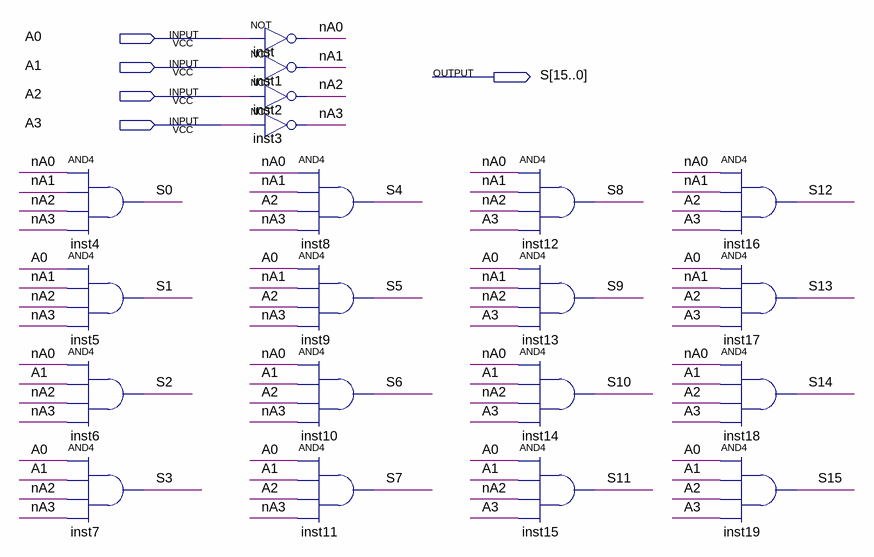
[diagram p0: schematic sheet]
// Quartus schematic decod.bdf as structural Verilog: 20 symbols, 5 pins
module decod (
  input  A0,
  input  A1,
  input  A2,
  input  A3,
  output [15:0] S
);

  wire nA0, nA1, nA2, nA3;

  and inst4 (S[0], nA0, nA1, nA2, nA3);
  and inst5 (S[1], A0, nA1, nA2, nA3);
  and inst6 (S[2], nA0, A1, nA2, nA3);
  and inst7 (S[3], A0, A1, nA2, nA3);
  not inst (nA0, A0);
  not inst1 (nA1, A1);
  not inst2 (nA2, A2);
  not inst3 (nA3, A3);
  and inst8 (S[4], nA0, nA1, A2, nA3);
  and inst9 (S[5], A0, nA1, A2, nA3);
  and inst10 (S[6], nA0, A1, A2, nA3);
  and inst11 (S[7], A0, A1, A2, nA3);
  and inst12 (S[8], nA0, nA1, nA2, A3);
  and inst13 (S[9], A0, nA1, nA2, A3);
  and inst14 (S[10], nA0, A1, nA2, A3);
  and inst15 (S[11], A0, A1, nA2, A3);
  and inst16 (S[12], nA0, nA1, A2, A3);
  and inst17 (S[13], A0, nA1, A2, A3);
  and inst18 (S[14], nA0, A1, A2, A3);
  and inst19 (S[15], A0, A1, A2, A3);
endmodule
